# Altium schematic sheet Esquematico_2.SchDoc
size A4
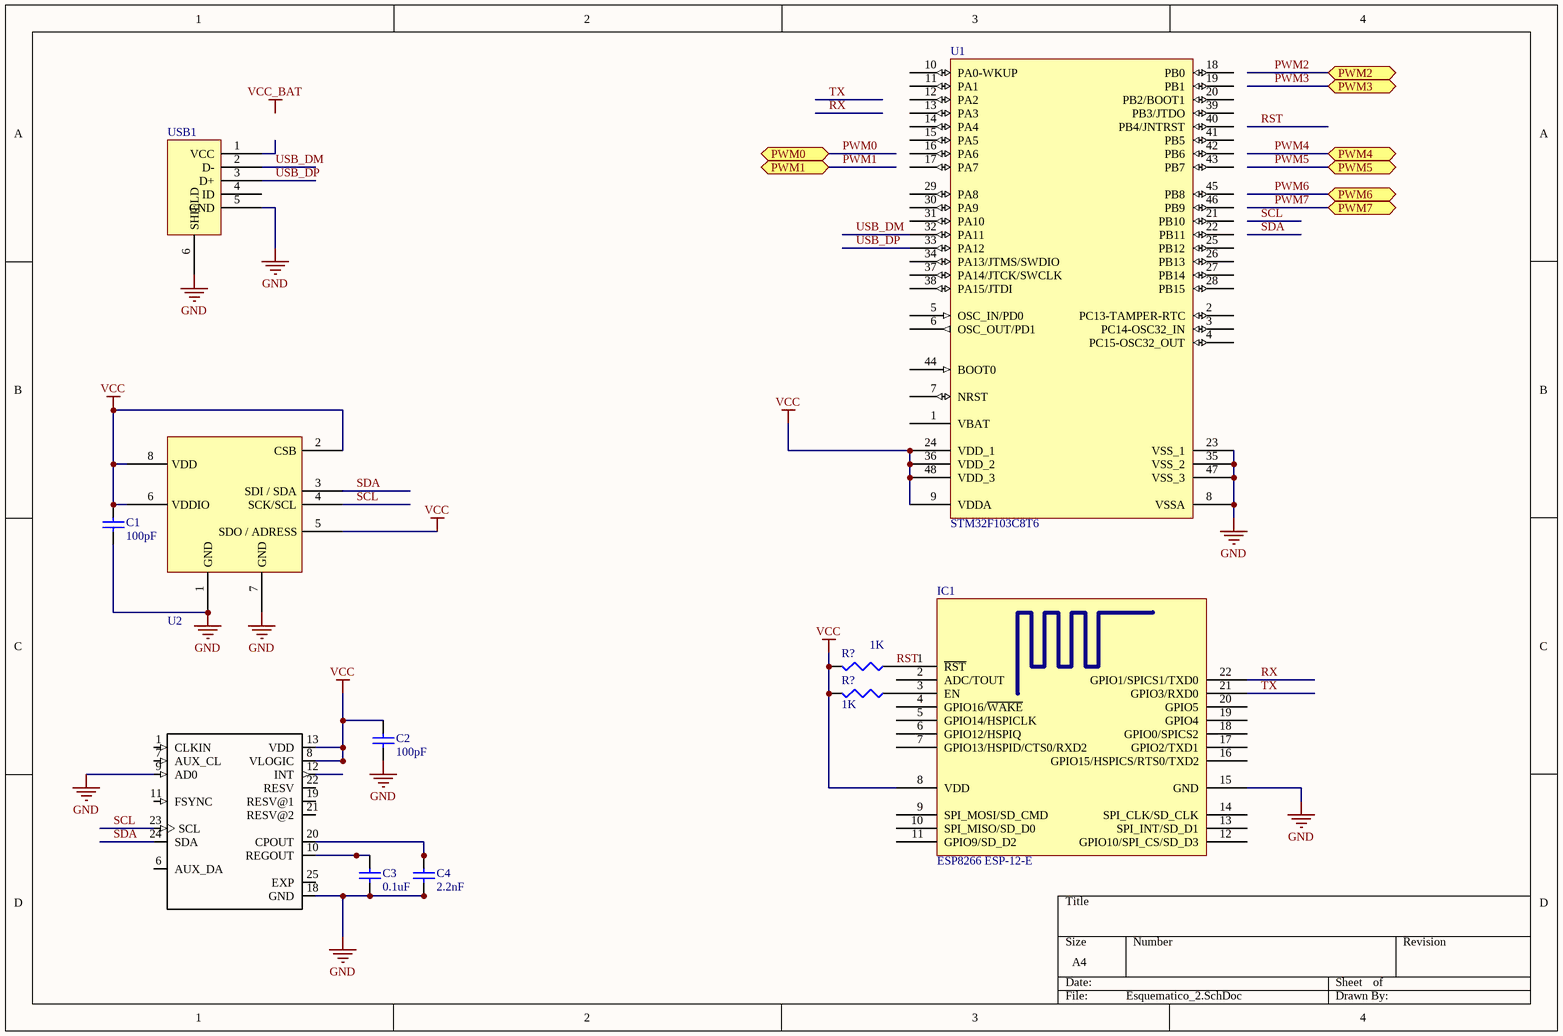
[diagram p0: Esquematico_2.SchDoc]

## Parts
(Parts that share a designator on the sheet are numbered #1, #2 ... from top to bottom, then left to right.)
C1  value 100pF  [6-0805_L]  (hidden comment: Cap)
C2  value 100pF  [6-0805_L]  (hidden comment: Cap)
C3  value 0.1uF  [6-0805_L]  (hidden comment: Cap)
C4  value 2.2nF  [6-0805_L]  (hidden comment: Cap)
IC1  ESP8266 ESP-12-E  [ESP8266 ESP-12-E B]
R?#1  value 1K  [6-0805_N]  (hidden comment: Res3)
R?#2  value 1K  [6-0805_N]  (hidden comment: Res3)
U1  STM32F103C8T6  [LQFP48_N]
U2  BMP280  [LGA-8_BMP280(Primary)]  (value not drawn)
U3  MPU-6050  [QFN50P400X400X95-25N]  (value not drawn)
USB1  Micro_USB  [Micro USB]  (value not drawn)

## Ports
PWM0, PWM1, PWM2, PWM3, PWM4, PWM5, PWM6, PWM7

## Nets
GND: C1.1 C2.1 C3.1 C4.1 IC1.15(GND) U1.8(VSSA) U1.23(VSS_1) U1.35(VSS_2) U1.47(VSS_3) U2.1(GND) U2.7(GND) U3.9(AD0) U3.18(GND) USB1.5(GND) USB1.6(SHIELD)
VCC: C1.2 C2.2 IC1.8(VDD) R?#1.2 R?#2.2 U1.9(VDDA) U1.24(VDD_1) U1.36(VDD_2) U1.48(VDD_3) U2.2(CSB) U2.5(SDO_/_ADRESS) U2.6(VDDIO) U2.8(VDD) U3.8(VLOGIC) U3.13(VDD)
PWM0: port PWM0
PWM1: port PWM1
PWM2: port PWM2
PWM3: port PWM3
PWM4: port PWM4
PWM5: port PWM5
PWM6: port PWM6
PWM7: port PWM7
RST: IC1.1(~{RST}) R?#1.1
RX: IC1.22(GPIO1/SPICS1/TXD0)
SCL: U2.4(SCK/SCL) U3.23(SCL)
SDA: U2.3(SDI_/_SDA) U3.24(SDA)
TX: IC1.21(GPIO3/RXD0)
USB_DM: U1.32(PA11) USB1.2(D-)
USB_DP: U1.33(PA12) USB1.3(D+)
NetC3_2: C3.2 U3.10(REGOUT)
NetC4_2: C4.2 U3.20(CPOUT)
NetIC1_3: IC1.3(EN) R?#2.1

Not connected (* = marked no-connect by the designer): IC1 2(ADC/TOUT) 4(GPIO16/~{WAKE}) 5(GPIO14/HSPICLK) 6(GPIO12/HSPIQ) 7(GPIO13/HSPID/CTS0/RXD2) 9(SPI_MOSI/SD_CMD) 10(SPI_MISO/SD_D0) 11(GPIO9/SD_D2) 12(GPIO10/SPI_CS/SD_D3) 13(SPI_INT/SD_D1) 14(SPI_CLK/SD_CLK) 16(GPIO15/HSPICS/RTS0/TXD2) 17(GPIO2/TXD1) 18(GPIO0/SPICS2) 19(GPIO4) 20(GPIO5); U1 1(VBAT) 2(PC13-TAMPER-RTC) 3(PC14-OSC32_IN) 4(PC15-OSC32_OUT) 5(OSC_IN/PD0) 6(OSC_OUT/PD1) 7(NRST) 10(PA0-WKUP) 11(PA1) 12(PA2) 13(PA3) 14(PA4) 15(PA5) 16(PA6) 17(PA7) 18(PB0) 19(PB1) 20(PB2/BOOT1) 21(PB10) 22(PB11) 25(PB12) 26(PB13) 27(PB14) 28(PB15) 29(PA8) 30(PA9) 31(PA10) 34(PA13/JTMS/SWDIO) 37(PA14/JTCK/SWCLK) 38(PA15/JTDI) 39(PB3/JTDO) 40(PB4/JNTRST) 41(PB5) 42(PB6) 43(PB7) 44(BOOT0) 45(PB8) 46(PB9); U3 1(CLKIN) 6(AUX_DA) 7(AUX_CL) 11(FSYNC) 12(INT) 19(RESV@1) 21(RESV@2) 22(RESV) 25(EXP); USB1 1(VCC) 4(ID)

## Notes on the sheet
- Labels drawn without touching a wire or pin: VCC_BAT

## Library data of the parts
C1-C4 = Cap: Capacitor; Published: 8-Jun-2000; LatestRevisionDate: 17-Jul-2002; LatestRevisionNote: Re-released for DXP Platform.; PackageReference: RAD-0.3; Publisher: Altium Limited; PackageDescription: Radial Cap, Thru-Hole; 2 Leads; 0.3 in Pin Spacing
R?#1 R?#2 = Res3: Resistor; Published: 8-Jun-2000; LatestRevisionDate: 29-May-2009; LatestRevisionNote: IPC-7351 Footprint Added.; PackageReference: J1-0603; Publisher: Altium Limited; PackageDescription: Chip Resistor
U1 = STM32F103C8T6: STM32 ARM-based 32-bit MCU with 64 Kbytes Flash, 48-pin LQFP, Industrial Temperature; Published: 30-May-2008; DatasheetVersion: rev6, Mar-2008; PackageVersion: Mar-2008; PackageReference: LQFP48; Publisher: Altium Limited; PackageDescription: 48-Pin Low-Profile Quad Flat Pack, 7 x 7 mm Body, 0.5 mm Pitch (LQFP48); ComponentLink1Description: Manufacturer Link; ComponentLink1URL: www.st.com/stm32; ComponentLink2Description: Datasheet; ComponentLink2URL: http://www.st.com/stonline/products/literature/ds/13587.pdf
U2 = BMP280: Barometro; Value: *
U3 = MPU-6050: Value: *